# EAGLE design reg_breadboard (EAGLE 6.5.0)

## Sheet 1 of 2
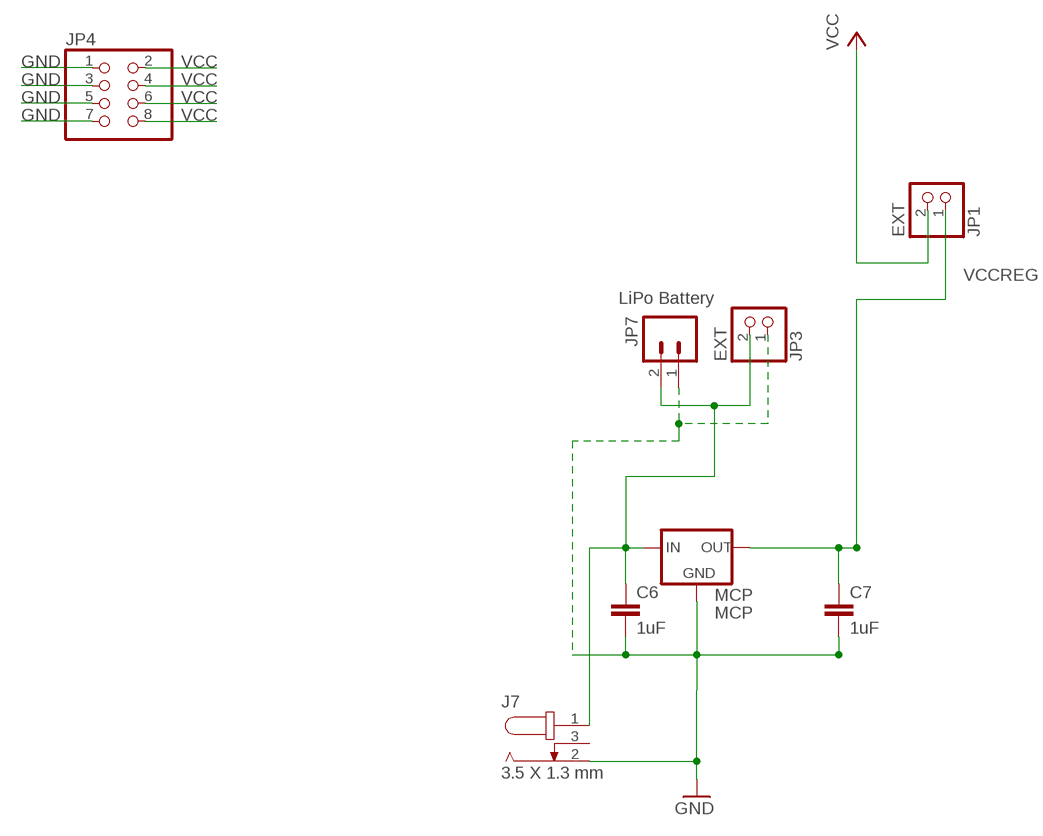
[diagram p0: schematic, sheet 1]

### Parts
C6  1uF  C-EUC0805  [C0805]
C7  1uF  C-EUC0805  [C0805]
J7  3.5 X 1.3 mm  DC_JACK_3.5X1.3MM  [3.5X1.3MM_DC_JACK]
JP1  EXT  PINHD-1X2  [1X02]
JP3  EXT  PINHD-1X2  [1X02]
JP4  PINHD-2X4  [2X04]
JP7  LiPo Battery  M02JST-PTH-2  [JST-2-PTH]
MCP  MCP  MCP1700SOT-23  [SOT-23]

### Nets
GND [GND]: C6.2 C7.2 J7.2 JP3.1 JP4.1 JP4.3 JP4.5 JP4.7 JP7.1 MCP.1(GND)
VCC [VCC]: JP1.2 JP4.2 JP4.4 JP4.6 JP4.8
VCCEXT [VCC]: C6.1 J7.1 JP3.2 JP7.2 MCP.3(IN)
VCCREG [VCC]: C7.1 JP1.1 MCP.2(OUT)
Unconnected: J7.3

## Sheet 2 of 2

## Library data of the parts
C6 C7 = resistor:C-EU: CAPACITOR, European symbol
J7 = MY_CONN:DC_JACK_3.5X1.3MM
JP1 JP3 = pinhead:PINHD-1X2: PIN HEADER
JP4 = pinhead:PINHD-2X4: PIN HEADER
JP7 = SparkFun:M02: Header 2 Standard 2-pin 0.1" header. Use with straight break away headers (SKU : PRT-00116), right angle break away headers (PRT-00553), swiss pins (PRT-00743), machine pins (PRT-00117), and female headers (PRT-00115). Molex polarized connector foot print use with SKU : PRT-08233 with associated crimp pins and housings.
MCP = MY_IC:MCP1700

## Net classes
1 GND: width 0.279 mm, drill 0.508 mm, clearance 0.254 mm
2 VCC: width 0.406 mm, drill 0.508 mm, clearance 0.254 mm

## Board
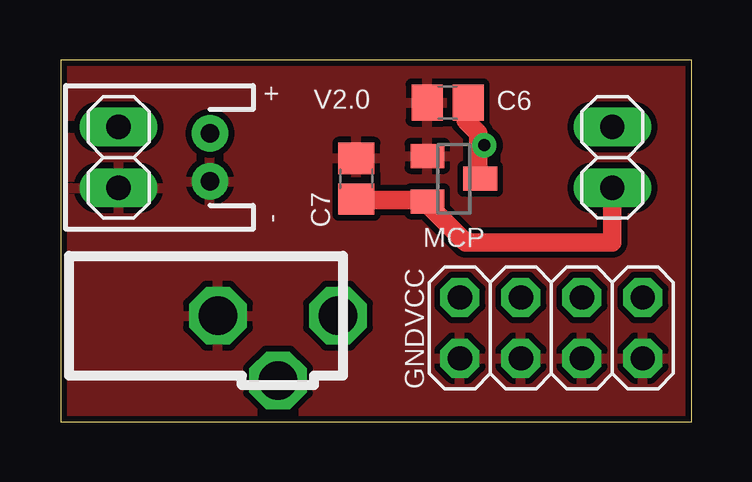
[diagram p1: board, top side]
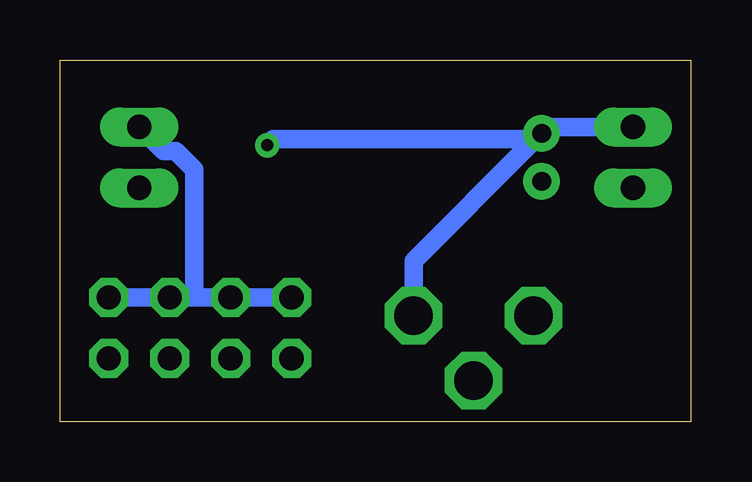
[diagram p2: board, bottom side, seen from below]

Size 26.29 x 15.09 mm. Coordinates in mm from the lower left corner, seen from the top.
Outline: 0,0 26.29,0 26.29,15.09 0,15.09 0,0
Copper layers (1*16): Top 0.035mm / dielectric 1.5mm / Bottom 0.035mm
Design rules "SparkFun *": minimum track width 30mil, minimum drill 20mil, track to track 8mil, track to pad 8mil, pad to pad 8mil, via to via 8mil, smd to smd 8mil, copper to edge 10mil, drill to drill 8mil, minimum pad ring 12mil, minimum via ring 10mil, stop-mask expansion 4mil, vias tented up to drill 25mil, thermal gap 10mil

### Footprints (pad centres in the part's own frame; a part is rotated, then mirrored left to right if it is on the bottom)
C0805 = smd 1.3 x 1.5: 1 -0.85,0; 2 0.85,0
3.5X1.3MM_DC_JACK = drill 1.6 octagon: 1 0,0; 2 -5,0; 3 -2.5,-2.7
1X02 = drill 1.016 long: 1 -1.27,0; 2 1.27,0
2X04 = drill 1.016 octagon: 1 -3.81,-1.27; 2 -3.81,1.27; 3 -1.27,-1.27; 4 -1.27,1.27; 5 1.27,-1.27; 6 1.27,1.27; 7 3.81,-1.27; 8 3.81,1.27
JST-2-PTH = drill 0.787 pad 1.524: 1 -1,0; 2 1,0
SOT-23 = smd 1 x 1.4: 1 -0.95,-1.1; 2 0.95,-1.1; 3 0,1.1

### Placement (x,y rotation side)
C6  16.13,13.32 180 top
C7  12.32,10.14 90 top
J7  11.56,4.43 0 top
JP1  22.99,11.03 90 top
JP3  2.41,11.03 90 top
JP4  20.45,3.92 0 top
JP7  6.22,11.03 90 top
MCP  16.38,10.14 270 top

### Tracks (layer width: path | path; a pad name or v marks a point on that pad's centre or on a via)
GND
  pour Top: -0.51,15.6 26.67,15.6 26.67,-0.4 -0.51,-0.4
VCC
  Bottom 0.762: JP4.2 JP4.4 20.7,5.19 | 20.7,5.19 JP4.6 JP4.8 | JP1.2 21.97,11.28 21.46,11.28 20.7,10.52 20.7,5.19
VCCEXT  (via drill 0.51)
  Top 0.762: 17.4,11.54 17.4,12.05 16.89,12.55 16.89,13.32 C6.1 | 17.4,11.54 17.4,10.27 MCP.3 | v17.65,11.54 17.4,11.54
  Bottom 0.762: v17.65,11.54 17.4,11.79 6.22,11.79 JP7.2 | JP3.2 5.97,12.3 JP7.2 | J7.1 11.56,6.71 6.73,11.54 JP7.2
VCCREG
  Top 0.762: C7.1 12.32,9.25 15.11,9.25 MCP.2 15.37,9 16.89,7.47 22.99,7.47 JP1.1

### Text on the board
tNames: + | V2.0 | - | VCC | GND